# Altium project Macropad_2025.PrjPcb
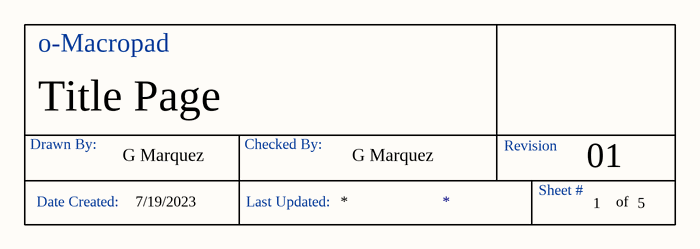
[diagram p0: Title Block.SchDoc]
Author: G Marquez; Project: o-Macropad
5 sheets, 55 parts. Net scope: flat (ports and power ports of the same name join across sheets).
Board file: Macropad2025.PcbDoc
Sheets:
  Title Block.SchDoc
  Power.SchDoc
  MCU.SchDoc
  Keyswitches.SchDoc
  Rotary LCD.SchDoc

## Sheet Title Block.SchDoc: Title Page
size B; Date: 7/19/2023; CheckedBy: G Marquez; Author: G Marquez; Organization: ORGANIZATION; Address1: ADDRESS 1; Address2: ADDRESS 2; Address3: ADDRESS 3; Address4: ADDRESS 4; Revision: 01; SheetNumber: 1; SheetTotal: 5; Project: o-Macropad; ENG_APP_DATE: --/--/--; DSN_APP_DATE: --/--/--; CHK_APP_DATE: --/--/--

### Parts
(Parts that share a designator on the sheet are numbered #1, #2 ... from top to bottom, then left to right.)
*#1  Title Block  (value not drawn)

### Notes on the sheet
- DWG. NO.
- REV.
- SHT.
- THIS DOCUMENT AND THE DATA DISCLOSED HEREIN OR HEREWITH IS THE PROPERTY OF ALTIUM LIMITED AND MAY BE FREELY DISTRIBUTED IN WHOLE. NO RIGHTS ARE RESERVED OR EXPRESS OR IMPLIED WARANTEE GIVEN.
- REVISION
- DESCRIPTION
- DATE
- APPROVED
- ENG:
- APPROVALS
- PROJECT
- DSN:
- CHK:
- REFERENCE DOCUMENTS
- PROJECT REVISION:
- TITLE
- DOCUMENT REVISION:
- DESIGN ITEM:
- BOM:
- FAB DWG:
- PCB DWG:
- ASSY DWG:
- SCALE:
- SIZE
- B
- CAGE CODE
- FILE NAME
- DWG NO.
- SHEET
- OF
- REV
- (in symbol Title Block) Drawn By:; Checked By:; Revision; Sheet #; Date Created:; Last Updated:; of

## Sheet Power.SchDoc: Power Supply
size B; Date: 7/29/2023; Revision: 00; SheetNumber: 2; SheetTotal: 5
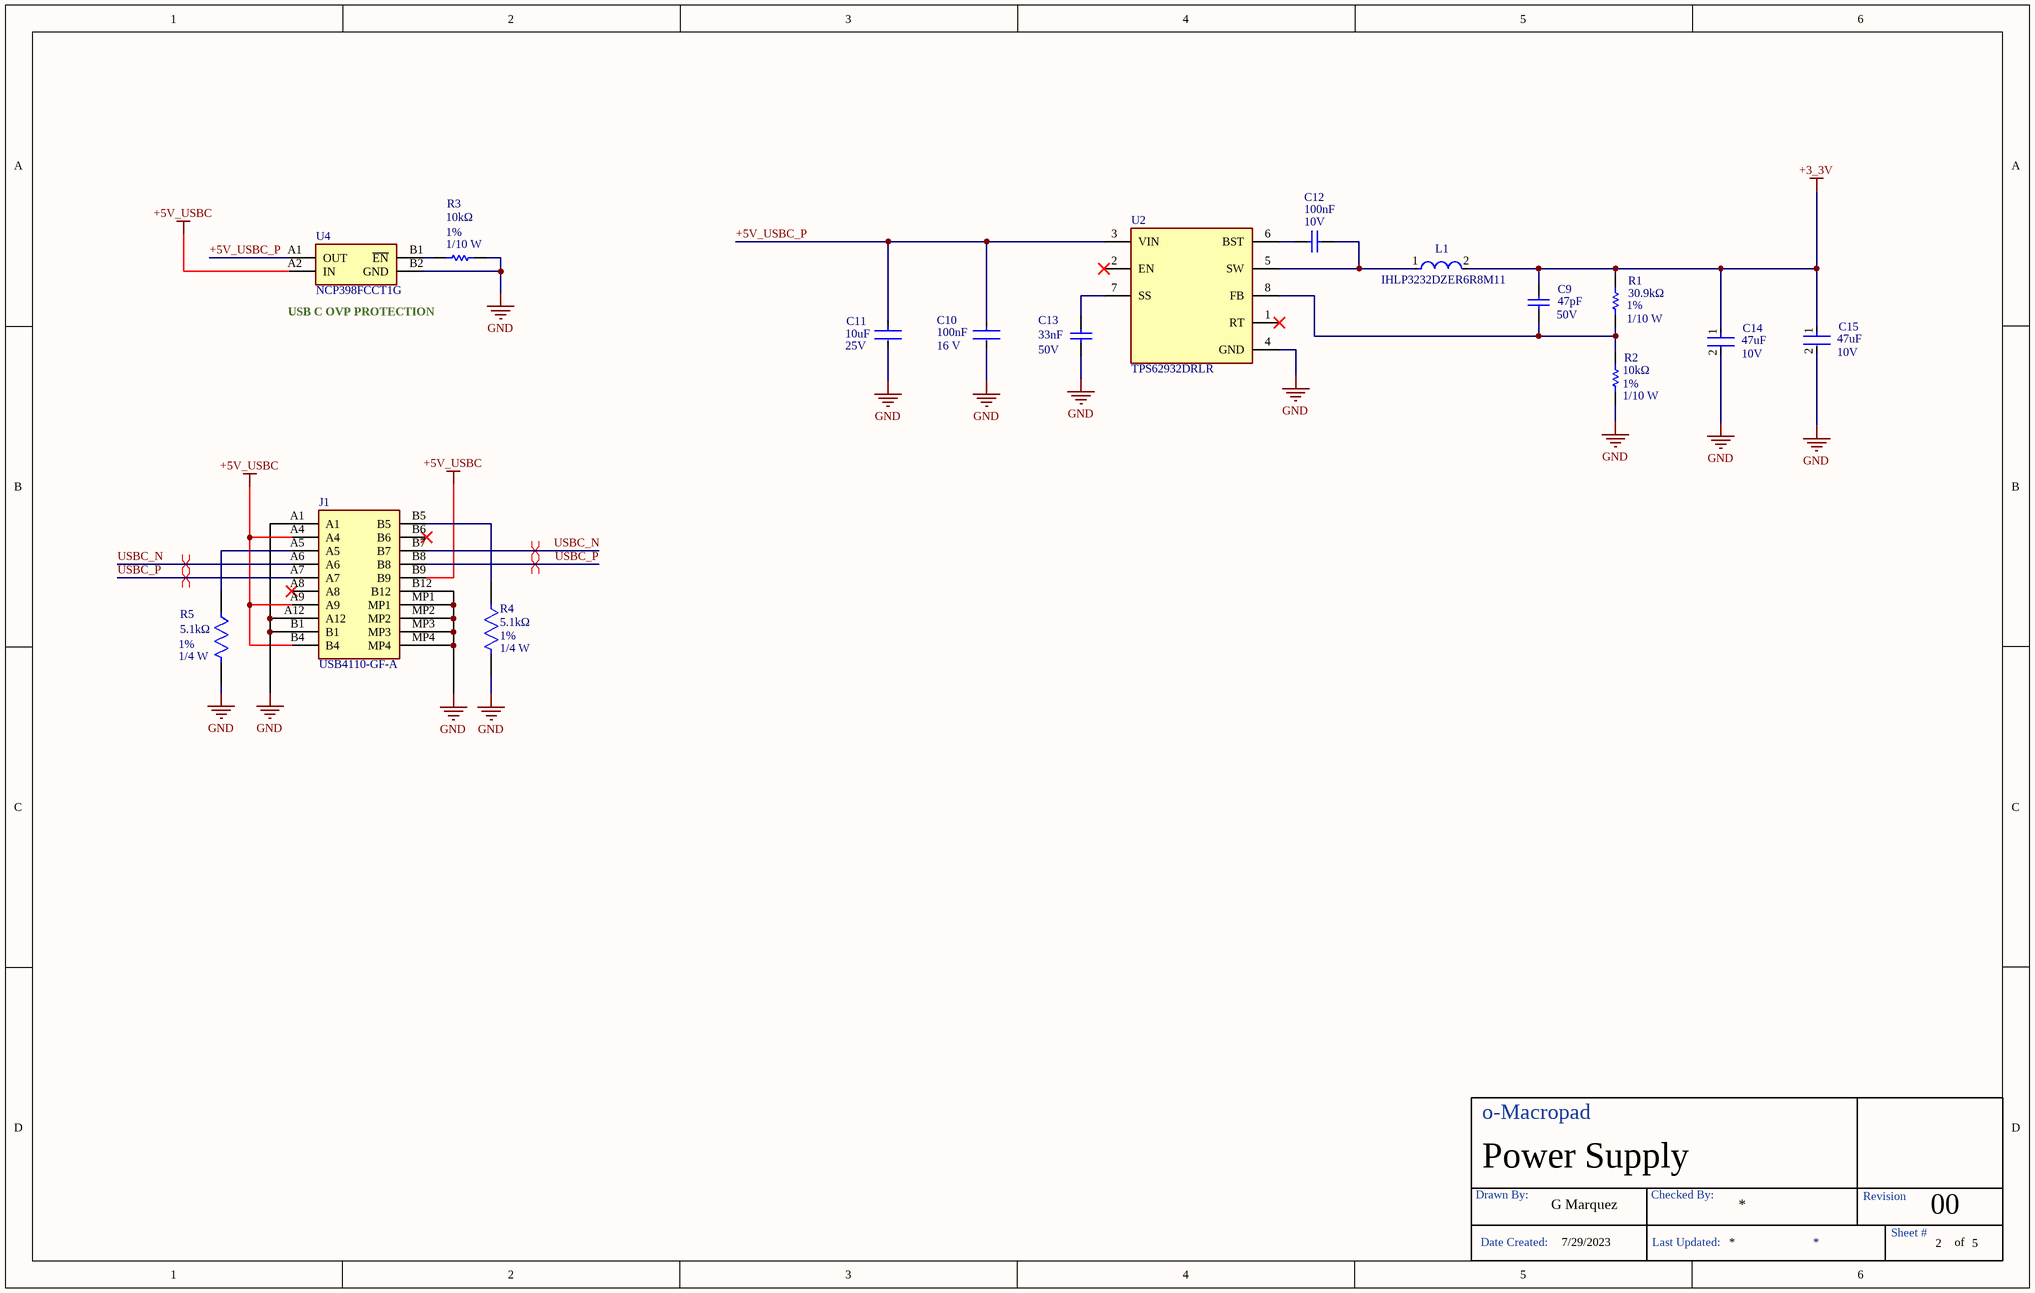
[diagram p1: Power.SchDoc]

### Parts
(Parts that share a designator on the sheet are numbered #1, #2 ... from top to bottom, then left to right.)
?#1  Title Block  (value not drawn)
C9  Capacitance: 47pF  Voltage Rating: 50V  [CAPC1608X90X35LL10T15]  (hidden comment: GQM1885C1H470JB01D)
C10  Capacitance: 100nF  Voltage Rating: 16 V  [FP-C0603C-CF-MFG]  (hidden comment: C0603C104K4RACTU)
C11  Voltage Rating: 25V  Capacitance: 10uF  [FP-C1608-080-IPC_A]  (hidden comment: C1608X5R1E106M080AC)
C12  Rated Voltage: 10V  Capacitance: 100nF  [CAPC1005X55X25LL05T10]  (hidden comment: GRM155R71A104KA01D)
C13  Capacitance: 33nF  Voltage Rating: 50V  [CAPC1608X90X35NL10T15]  (hidden comment: GRM188R71H333KA61D)
C14  Capacitance: 47uF  Voltage Rating: 10V  [FP-C2012-125-0_2-IPC_B]  (hidden comment: C2012X5R1A476M125AC)
C15  Capacitance: 47uF  Voltage Rating: 10V  [FP-C2012-125-0_2-IPC_B]  (hidden comment: C2012X5R1A476M125AC)
J1  USB4110-GF-A  [USB4110GFA]
L1  IHLP3232DZER6R8M11  [FP-IHLP-3232DZ-FP_2_413x5-MFG]
R1  Resistance: 30.9kΩ  Tolerance: 1%  Power Rating: 1/10 W  [RESC1609X50X30LL10T20]  (hidden comment: CRCW060330K9FKEA)
R2  Resistance: 10kΩ  Tolerance: 1%  Power Rating: 1/10 W  [RESC1609X50X30NL8T20]  (hidden comment: CRCW060310K0FKEA)
R3  Resistance: 10kΩ  Tolerance: 1%  Power Rating: 1/10 W  [RESC1609X50X30NL8T20]  (hidden comment: CRCW060310K0FKEA)
R4  Tolerance: 1%  Max Power Dissipation: 1/4 W  Resistance: 5.1kΩ  [FP-CRCW0603-HPe3-MFG]  (hidden comment: CRCW06035K10FKEAHP)
R5  Tolerance: 1%  Max Power Dissipation: 1/4 W  Resistance: 5.1kΩ  [FP-CRCW0603-HPe3-MFG]  (hidden comment: CRCW06035K10FKEAHP)
U2  TPS62932DRLR  [FP-DRL0008A-MFG]
U4  NCP398FCCT1G  [BGA4C40P2X2_84X84X60]

### Nets
+3_3V: C9.2 C14.1 C15.1 L1.2 R1.2
+5V_USBC: J1.A4 J1.A9 J1.B4 J1.B9 U4.A2(IN)
GND: C10.2 C11.2 C13.1 C14.2 C15.2 J1.A1 J1.A12 J1.B1 J1.B12 J1.MP1 J1.MP2 J1.MP3 J1.MP4 R2.1 R3.1 R4.2 R5.2 U2.4(GND) U4.B2(GND)
+5V_USBC_P: C10.1 C11.1 U2.3(VIN) U4.A1(OUT)
USBC_N: J1.A6 J1.B7
USBC_P: J1.A7 J1.B8
NetC9_1: C9.1 R1.1 R2.2 U2.8(FB)
NetC12_1: C12.1 U2.6(BST)
NetC12_2: C12.2 L1.1 U2.5(SW)
NetC13_2: C13.2 U2.7(SS)
NetJ1_A5: J1.A5 R5.1
NetJ1_B5: J1.B5 R4.1
NetR3_2: R3.2 U4.B1(~{EN})

Not connected (* = marked no-connect by the designer): J1 A8* B6*; U2 1(RT)* 2(EN)*

### Layout directives
differential pair: USBC_N, USBC_P

### Notes on the sheet
- (near U4) USB C OVP PROTECTION
- (in symbol Title Block) Drawn By:; Checked By:; Revision; Sheet #; Date Created:; Last Updated:; of

### Library data of the parts
C9 = CMP-2006-02430-1: Manufacturer: Murata; Part Number: GQM1885C1H470JB01D
C10 = CMP-2006-03811-3: Capacitor; Ceramic; Cap; .100uF; Tol 10%; SMT; Vol-Rtg 16V; X7R; Tape and Reel; Manufacturer: KEMET; Value: 0.10 μF; Temperature Coefficient: 30ppm/°C; Automotive Grade: Grade 1; Tolerance: 0.1; Digikey Description: Capacitor; Ceramic; Cap; .100uF; Tol 10%; SMT; Vol-Rtg 16V; X7R; Tape and Reel; Automotive: Yes; Temperature Range High: +125°C; Device Class L1: Passive Components; Material: Ceramic; Lead Free: Yes; Device Class L2: Capacitors; Height: 0.87mm; Manufacturer Part Number: C0603C104K4RACTU; Octopart: https://octopart.com/c0603c104k4ractu-kemet-93067; Package: C0603C-CF; Temperature Characteristic: X7R; Device Class L3: Ceramic Capacitors; ComponentLink2URL: https://api.kemet.com/component-edge/download/datasheet/C0603C100J5GACAUTO.pdf; Temperature Range Low: -55°C; ComponentLink2Description: Datasheet; Mouser Description: Multilayer Ceramic Capacitors MLCC - SMD/SMT 16volts 0.1uF 10% X7R 10%; RoHS: TRUE; Temperature: -55°C to +125°C; Category: Cap
C11 = CMP-2000-05442-2: CAP CER 10UF 25V X5R 0603; Dielectric Material: Ceramic; Tolerance: 20%; Dielectric: X5R; Length: 1.6mm; Termination: SMD/SMT; Depth: 0.8mm; RoHS Compliant: Yes; Construction: Flat; Weight: 7.1E-05oz; Thickness: 0.039inch; Packaging: Tape and Reel; Min Operating Temperature: -55°C; Case Code (Imperial): 0603; Case/Package: 0603; Height: 0.8mm; Case Code (Metric): 1608; Resistor Type: Ceramic; Voltage Rating (DC): 25V; Max Operating Temperature: 85°C; REACH SVHC: No SVHC; Lead Free: Lead Free; Series: C; Width: 0.8mm; Mount: Surface Mount; Package Quantity: 1
C12 = CMP-2000-06331-1: Chip Capacitor, 0.1 uF, +/- 10%, 10 V, -55 to 125 degC, 0402 (1005 Metric), RoHS, Tape and Reel; Manufacturer: Murata; Dielectric: X7R; Manufacturer URL: http://www.murata.com/; Datasheet Version: 02/2016; Datasheet URL: http://search.murata.co.jp/Ceramy/image/img/A01X/G101/ENG/GRM155R71A104KA01-01.pdf; Package Reference: 0402; Tolerance (%): ±10%; Package Description: 2-Pin Surface Mount Device, Body 1 x 0.5 mm; Mounting Technology: SurfaceMount; Case Size/Dimension: 0402
C13 = CMP-2006-02918-1: Manufacturer: Murata; Part Number: GRM188R71H333KA61D
C14 C15 = CMP-2000-05451-2: Multilayer Ceramic Capacitors 47μF ±20% 10V X5R SMD 0805; RoHS Compliant: Yes; Dielectric: X5R; Case Code (Imperial): 0805; Min Operating Temperature: -55°C; Length: 2mm; Lead Free: Lead Free; Weight: 0.000194oz; Resistor Type: Ceramic; Dielectric Material: Ceramic; Max Operating Temperature: 85°C; Height: 1.25mm; Width: 0.049inch; Depth: 1.25mm; Termination: SMD/SMT; Case/Package: 0805; Voltage Rating (DC): 10V; Voltage: 10V; Thickness: 0.057inch; Tolerance: 20%; REACH SVHC: No SVHC; Package Quantity: 1; Series: C; Case Code (Metric): 2012; Mount: Surface Mount; Packaging: Tape and Reel
J1 = USB4110-GF-A: Connector; Manufacturer_Name: GCT (GLOBAL CONNECTOR TECHNOLOGY); Datasheet Link: https://gct.co/files/drawings/usb4110.pdf; Height: 3.26mm; Manufacturer_Part_Number: USB4110-GF-A
L1 = CMP-02424-000226-1: Commercial Inductors, Low DCR Series 6.8uH 7A 33.4mΩ 20%; Test Frequency: 100kHz; Max DC Current: 6.7A; Core Material: Ferrite; DC Resistance (DCR): 33.4mR; Self Resonant Frequency: 13MHz; Shielding: Shielded; Lead Free: Lead Free; Min Operating Temperature: -55°C; Max Operating Temperature: 125°C; Military Standard: Not; Number of Pins: 2; Length: 0.34inch; Width: 8.18mm; Height - Seated (Max): 0.157inch; Depth: 8.26mm; Package Quantity: 500; Packaging: Tape and Reel; Inductance Tolerance: 20%; Saturation Current: 6.7A; Tolerance: 20%; Mount: Surface Mount; RMS Current (Irms): 7A; Termination: SMD/SMT; Current Rating: 7A; Height: 4mm; Case/Package: 3232; Radiation Hardening: No; Inductance: 6.8uH
R1 = CMP-2000-03227-1: Manufacturer: Vishay Dale; Part Number: CRCW060330K9FKEA
R2 R3 = CMP-1666-00005-4: Chip Resistor, 10 KOhm, +/- 1%, 100 mW, -55 to 155 degC, 0603 (1608 Metric), RoHS, Tape and Reel; Manufacturer: Vishay Semiconductor; Voltage Rating: 75 V; Max Operating Temperature: 155 degC; PackageDescription: 2-Pin Surface Mount Device, Body 1.575 x 0.85 mm; ComponentLink1Description: Manufacturer URL; RoHSCompliant: true; PackageReference: 0603; REACH SVHC: Unknown; Length: 1.55 mm; DatasheetVersion: 06/2012; Packaging: Tape and Reel; Min Operating Temperature: -55 degC; Mounting Technology: Surface Mount; ComponentLink2URL: https://datasheet.ciiva.com/11809/0900766b80d98afc-11809037.pdf; Height: 0.45 mm; ComponentLink2Description: Datasheet; Package Quantity: 5000; ComponentLink1URL: http://www.vishay.com/
R4 R5 = CMP-02407-006055-1: RES Thick Film, 5.1kΩ, 1%, 0.33W, 100ppm/°C, 0603; Power Rating: 250mW; Width: 0.033inch; Mount: Surface Mount; Number of Terminations: 2; Depth: 0.85mm; Case Code (Metric): 1608; Height: 0.022inch; Features: Automotive AEC-Q200; Military Standard: Not; Max Operating Temperature: 155°C; Contact Plating: Tin; Packaging: Tape and Reel; Temperature Coefficient: 100ppm/°C; Case/Package: 0603; Composition: Thick Film; Min Operating Temperature: -55°C; Length: 1.6mm; Radiation Hardening: No; Case Code (Imperial): 0603; Lead Free: Lead Free; Package Quantity: 5000
U2 = CMP-04918-000714-1: 3.8-V TO 30-V INPUT, 2-A, 200-KH
U4 = NCP398FCCT1G: Integrated Circuit; Manufacturer_Name: onsemi; Datasheet Link: https://www.onsemi.com/pub/Collateral/NCP398-D.PDF; Height: 0.6mm; Manufacturer_Part_Number: NCP398FCCT1G; Mouser Part Number: 863-NCP398FCCT1G; Mouser Price/Stock: https://www.mouser.co.uk/ProductDetail/onsemi/NCP398FCCT1G?qs=8hV9pjh0QhMpkPl4ZTT5TA%3D%3D; Arrow Part Number: NCP398FCCT1G; Arrow Price/Stock: https://www.arrow.com/en/products/ncp398fcct1g/on-semiconductor

## Sheet MCU.SchDoc: Microprocessor
size B; Date: 7/18/2023; CheckedBy: G Marquez; Author: G Marquez; Organization: ORGANIZATION; Address1: ADDRESS 1; Address2: ADDRESS 2; Address3: ADDRESS 3; Address4: ADDRESS 4; Revision: 01; SheetNumber: 3; SheetTotal: 5; Project: o-Macropad; ENG_APP_DATE: --/--/--; DSN_APP_DATE: --/--/--; CHK_APP_DATE: --/--/--
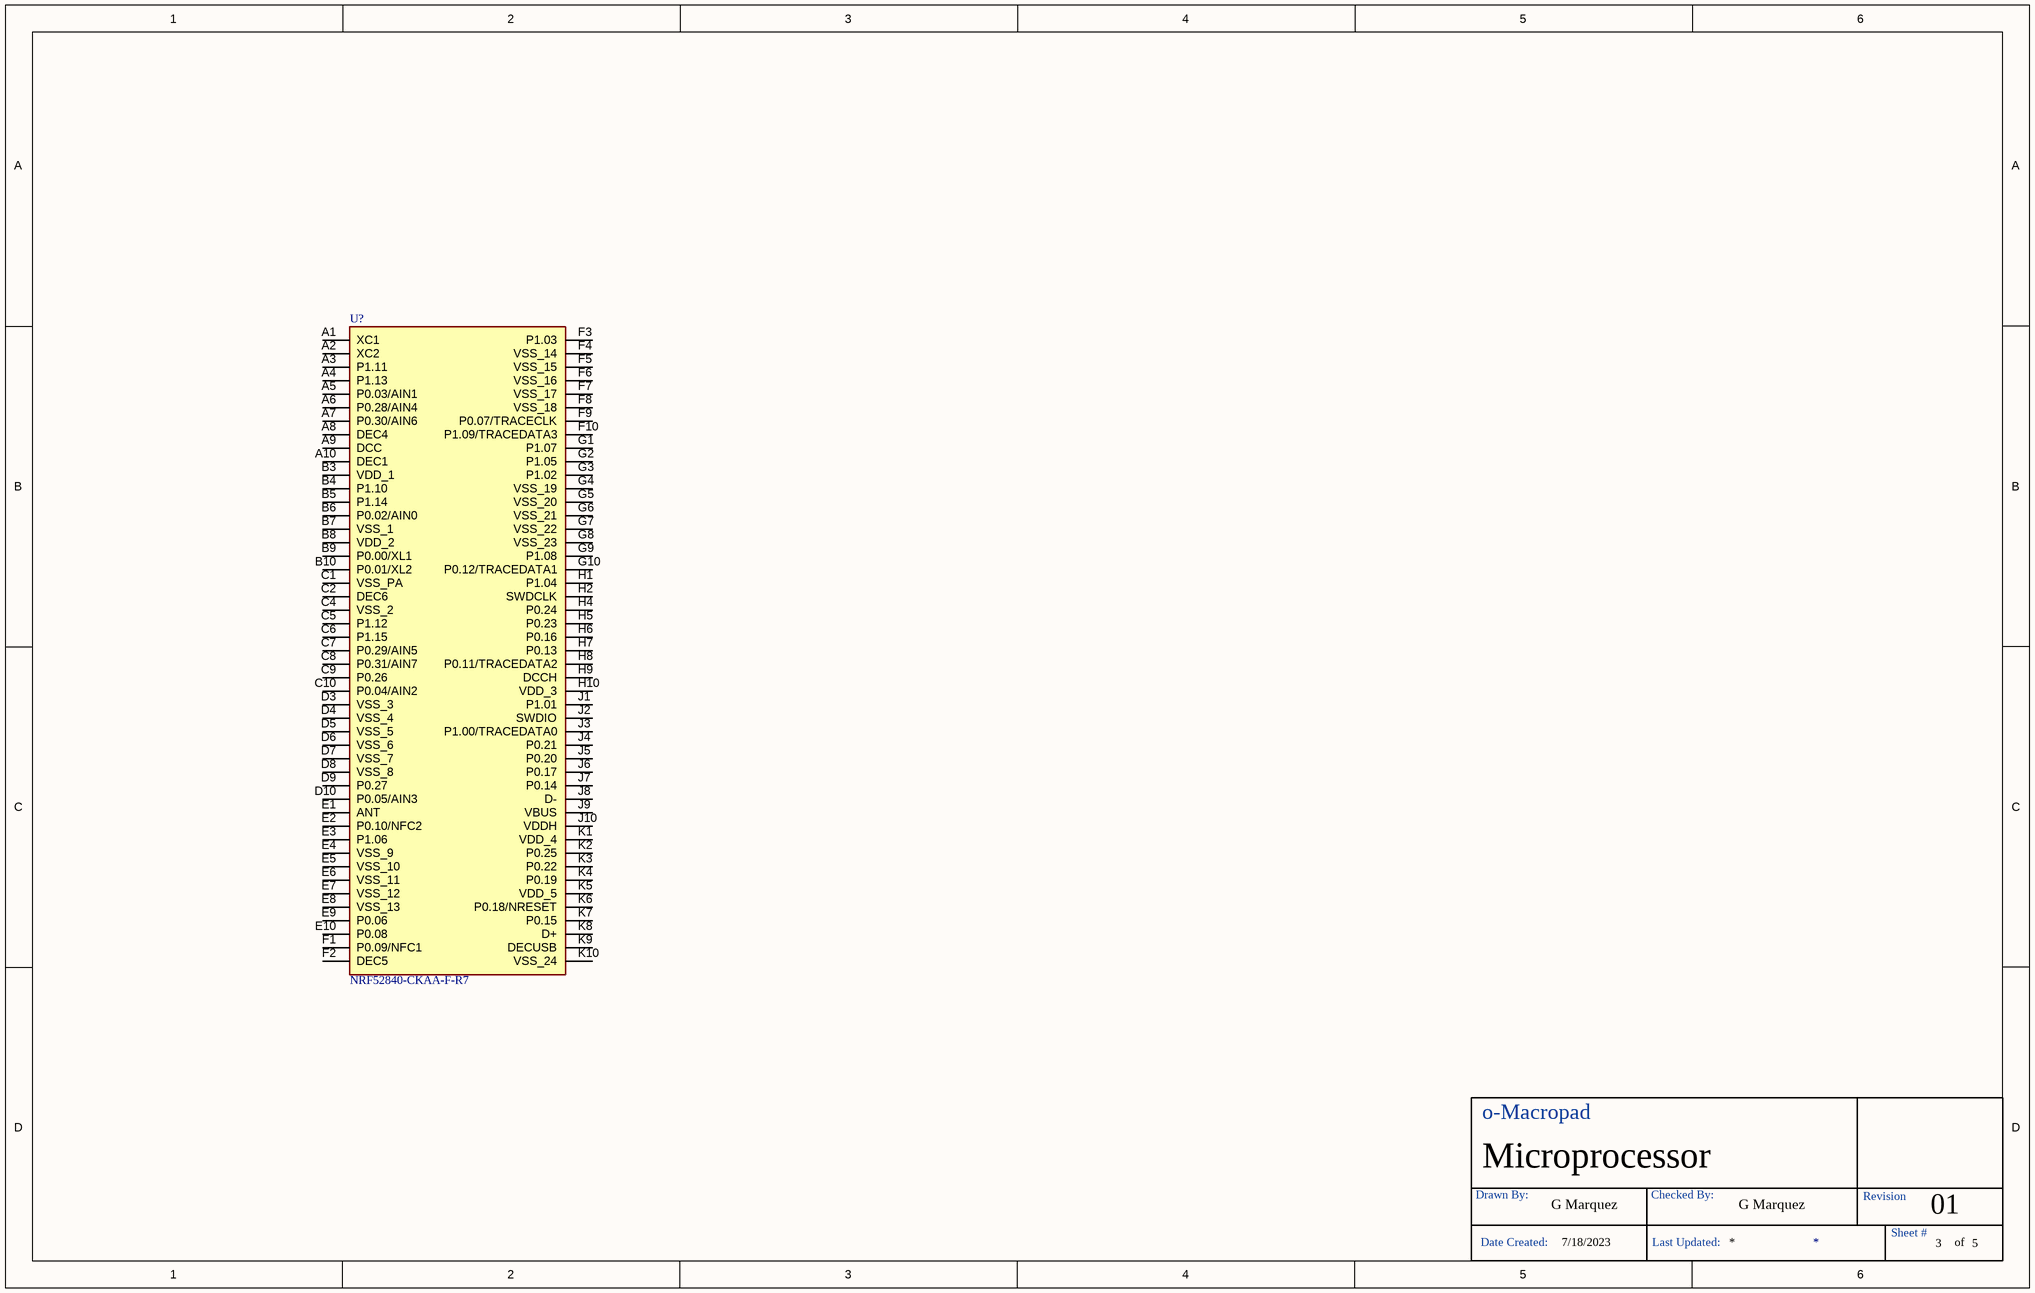
[diagram p2: MCU.SchDoc]

### Parts
(Parts that share a designator on the sheet are numbered #1, #2 ... from top to bottom, then left to right.)
*#2  Title Block  (value not drawn)
U?  NRF52840-CKAA-F-R7  [BGA94C35P10X10_354X361X51]

### Nets

Not connected (* = marked no-connect by the designer): U? A1(XC1) A2(XC2) A3(P1.11) A4(P1.13) A5(P0.03/AIN1) A6(P0.28/AIN4) A7(P0.30/AIN6) A8(DEC4) A9(DCC) A10(DEC1) B3(VDD_1) B4(P1.10) B5(P1.14) B6(P0.02/AIN0) B7(VSS_1) B8(VDD_2) B9(P0.00/XL1) B10(P0.01/XL2) C1(VSS_PA) C2(DEC6) C4(VSS_2) C5(P1.12) C6(P1.15) C7(P0.29/AIN5) C8(P0.31/AIN7) C9(P0.26) C10(P0.04/AIN2) D3(VSS_3) D4(VSS_4) D5(VSS_5) D6(VSS_6) D7(VSS_7) D8(VSS_8) D9(P0.27) D10(P0.05/AIN3) E1(ANT) E2(P0.10/NFC2) E3(P1.06) E4(VSS_9) E5(VSS_10) E6(VSS_11) E7(VSS_12) E8(VSS_13) E9(P0.06) E10(P0.08) F1(P0.09/NFC1) F2(DEC5) F3(P1.03) F4(VSS_14) F5(VSS_15) F6(VSS_16) F7(VSS_17) F8(VSS_18) F9(P0.07/TRACECLK) F10(P1.09/TRACEDATA3) G1(P1.07) G2(P1.05) G3(P1.02) G4(VSS_19) G5(VSS_20) G6(VSS_21) G7(VSS_22) G8(VSS_23) G9(P1.08) G10(P0.12/TRACEDATA1) H1(P1.04) H2(SWDCLK) H4(P0.24) H5(P0.23) H6(P0.16) H7(P0.13) H8(P0.11/TRACEDATA2) H9(DCCH) H10(VDD_3) J1(P1.01) J2(SWDIO) J3(P1.00/TRACEDATA0) J4(P0.21) J5(P0.20) J6(P0.17) J7(P0.14) J8(D-) J9(VBUS) J10(VDDH) K1(VDD_4) K2(P0.25) K3(P0.22) K4(P0.19) K5(VDD_5) K6(P0.18/NRESET) K7(P0.15) K8(D+) K9(DECUSB) K10(VSS_24)

### Notes on the sheet
- DWG. NO.
- REV.
- SHT.
- THIS DOCUMENT AND THE DATA DISCLOSED HEREIN OR HEREWITH IS THE PROPERTY OF ALTIUM LIMITED AND MAY BE FREELY DISTRIBUTED IN WHOLE. NO RIGHTS ARE RESERVED OR EXPRESS OR IMPLIED WARANTEE GIVEN.
- REVISION
- DESCRIPTION
- DATE
- APPROVED
- ENG:
- APPROVALS
- PROJECT
- DSN:
- CHK:
- REFERENCE DOCUMENTS
- PROJECT REVISION:
- TITLE
- DOCUMENT REVISION:
- DESIGN ITEM:
- BOM:
- FAB DWG:
- PCB DWG:
- ASSY DWG:
- SCALE:
- SIZE
- B
- CAGE CODE
- FILE NAME
- DWG NO.
- SHEET
- OF
- REV
- (in symbol Title Block) Drawn By:; Checked By:; Revision; Sheet #; Date Created:; Last Updated:; of

### Library data of the parts
U? = NRF52840-CKAA-F-R7: Integrated Circuit; Manufacturer_Name: Nordic Semiconductor; Datasheet Link: https://infocenter.nordicsemi.com/pdf/nRF52840_PS_v1.7.pdf; Height: 0.514mm; Manufacturer_Part_Number: NRF52840-CKAA-F-R7; Mouser Part Number: 949-NRF52840CKAAF-R7; Mouser Price/Stock: https://www.mouser.co.uk/ProductDetail/Nordic-Semiconductor/nRF52840-CKAA-F-R7?qs=TCDPyi3sCW3UO0%252BPeBf5YQ%3D%3D; Arrow Part Number: NRF52840-CKAA-F-R7; Arrow Price/Stock: https://www.arrow.com/en/products/nrf52840-ckaa-f-r7/nordic-semiconductor?utm_currency=USD&region=nac

## Sheet Keyswitches.SchDoc: Key Switches & LED
size B; Date: 7/22/2023; Revision: 01; SheetNumber: 4; SheetTotal: 4
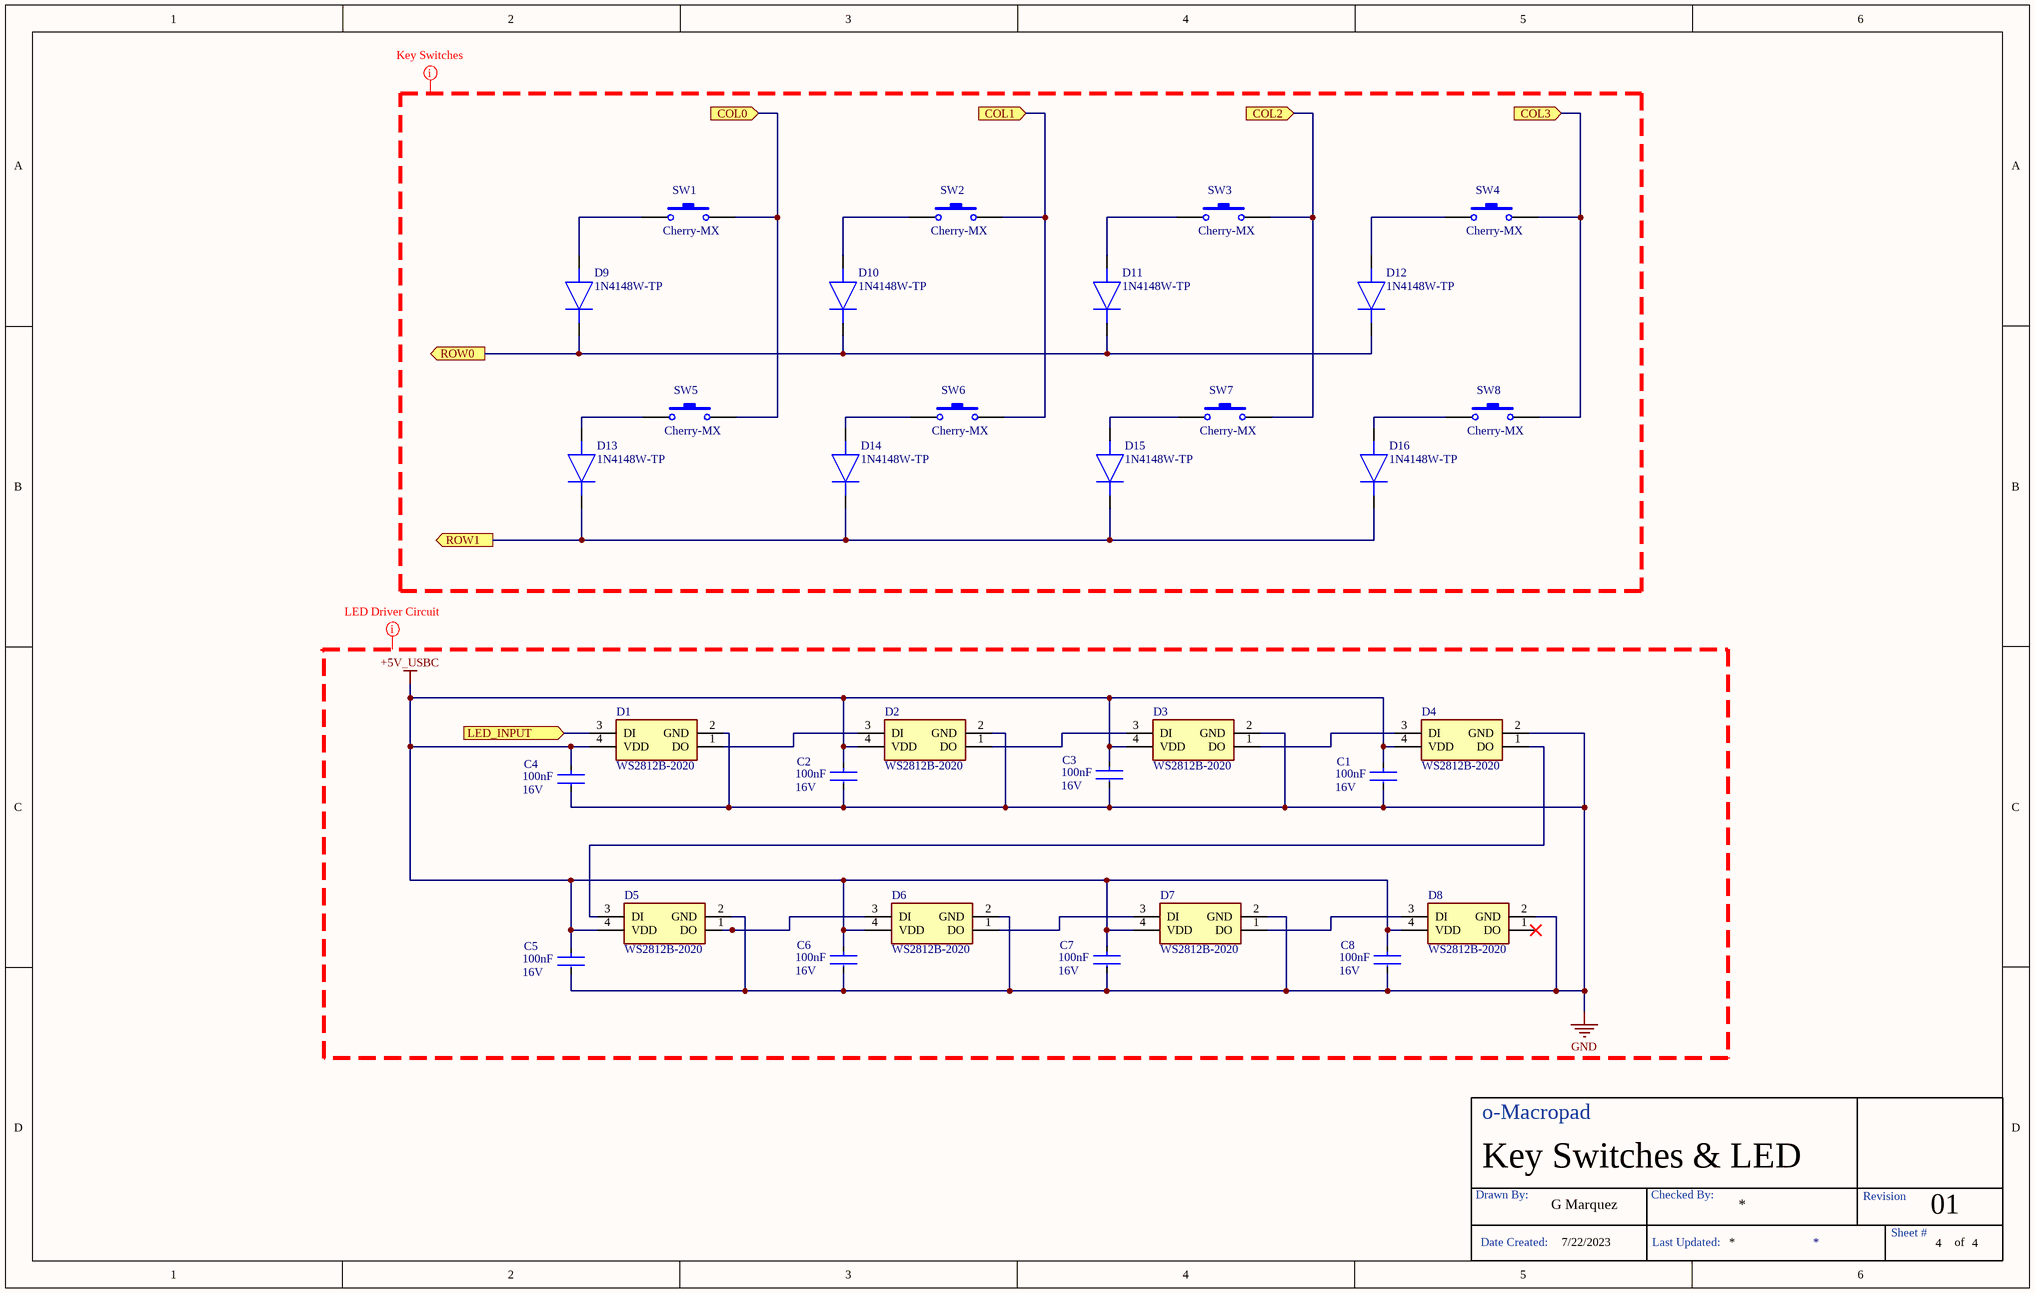
[diagram p3: Keyswitches.SchDoc]

### Parts
(Parts that share a designator on the sheet are numbered #1, #2 ... from top to bottom, then left to right.)
?#2  Title Block  (value not drawn)
C1  Voltage Rating: 16V  Capacitance: 100nF  [FP-GRM15-MFG]  (hidden comment: GRM155R71C104KA88D)
C2  Voltage Rating: 16V  Capacitance: 100nF  [FP-GRM15-MFG]  (hidden comment: GRM155R71C104KA88D)
C3  Voltage Rating: 16V  Capacitance: 100nF  [FP-GRM15-MFG]  (hidden comment: GRM155R71C104KA88D)
C4  Voltage Rating: 16V  Capacitance: 100nF  [FP-GRM15-MFG]  (hidden comment: GRM155R71C104KA88D)
C5  Voltage Rating: 16V  Capacitance: 100nF  [FP-GRM15-MFG]  (hidden comment: GRM155R71C104KA88D)
C6  Voltage Rating: 16V  Capacitance: 100nF  [FP-GRM15-MFG]  (hidden comment: GRM155R71C104KA88D)
C7  Voltage Rating: 16V  Capacitance: 100nF  [FP-GRM15-MFG]  (hidden comment: GRM155R71C104KA88D)
C8  Voltage Rating: 16V  Capacitance: 100nF  [FP-GRM15-MFG]  (hidden comment: GRM155R71C104KA88D)
D1  WS2812B-2020  [WS2812B2020]
D2  WS2812B-2020  [WS2812B2020]
D3  WS2812B-2020  [WS2812B2020]
D4  WS2812B-2020  [WS2812B2020]
D5  WS2812B-2020  [WS2812B2020]
D6  WS2812B-2020  [WS2812B2020]
D7  WS2812B-2020  [WS2812B2020]
D8  WS2812B-2020  [WS2812B2020]
D9  1N4148W-TP  [SOD3715X135N]
D10  1N4148W-TP  [SOD3715X135N]
D11  1N4148W-TP  [SOD3715X135N]
D12  1N4148W-TP  [SOD3715X135N]
D13  1N4148W-TP  [SOD3715X135N]
D14  1N4148W-TP  [SOD3715X135N]
D15  1N4148W-TP  [SOD3715X135N]
D16  1N4148W-TP  [SOD3715X135N]
SW1  Cherry-MX  [CHERRYMX_1.00U_HOTSWAP_NOSILK]
SW2  Cherry-MX  [CHERRYMX_1.00U_HOTSWAP_NOSILK]
SW3  Cherry-MX  [CHERRYMX_1.00U_HOTSWAP_NOSILK]
SW4  Cherry-MX  [CHERRYMX_1.00U_HOTSWAP_NOSILK]
SW5  Cherry-MX  [CHERRYMX_1.00U_HOTSWAP_NOSILK]
SW6  Cherry-MX  [CHERRYMX_1.00U_HOTSWAP_NOSILK]
SW7  Cherry-MX  [CHERRYMX_1.00U_HOTSWAP_NOSILK]
SW8  Cherry-MX  [CHERRYMX_1.00U_HOTSWAP_NOSILK]

### Ports
COL0 (in), COL1 (in), COL2 (in), COL3 (in), LED_INPUT (in), ROW0 (out), ROW1 (out)

### Nets
+5V_USBC: C1.2 C2.2 C3.2 C4.2 C5.2 C6.2 C7.2 C8.2 D1.4(VDD) D2.4(VDD) D3.4(VDD) D4.4(VDD) D5.4(VDD) D6.4(VDD) D7.4(VDD) D8.4(VDD)
GND: C1.1 C2.1 C3.1 C4.1 C5.1 C6.1 C7.1 C8.1 D1.2(GND) D2.2(GND) D3.2(GND) D4.2(GND) D5.2(GND) D6.2(GND) D7.2(GND) D8.2(GND)
NetD1_1: D1.1(DO) D2.3(DI)
NetD1_3: D1.3(DI) ; port LED_INPUT
NetD2_1: D2.1(DO) D3.3(DI)
NetD3_1: D3.1(DO) D4.3(DI)
NetD4_1: D4.1(DO) D5.3(DI)
NetD5_1: D5.1(DO) D6.3(DI)
NetD6_1: D6.1(DO) D7.3(DI)
NetD7_1: D7.1(DO) D8.3(DI)
NetD9_1: D9.1(K) D10.1(K) D11.1(K) D12.1(K) ; port ROW0
NetD9_2: D9.2(A) SW1.1
NetD10_2: D10.2(A) SW2.1
NetD11_2: D11.2(A) SW3.1
NetD12_2: D12.2(A) SW4.1
NetD13_1: D13.1(K) D14.1(K) D15.1(K) D16.1(K) ; port ROW1
NetD13_2: D13.2(A) SW5.1
NetD14_2: D14.2(A) SW6.1
NetD15_2: D15.2(A) SW7.1
NetD16_2: D16.2(A) SW8.1
NetSW1_2: SW1.2 SW5.2 ; port COL0
NetSW2_2: SW2.2 SW6.2 ; port COL1
NetSW3_2: SW3.2 SW7.2 ; port COL2
NetSW4_2: SW4.2 SW8.2 ; port COL3

Not connected (* = marked no-connect by the designer): D8 1(DO)*

### Layout directives
mark named LED Driver Circuit: +5V_USBC, GND
mark named Key Switches: (no net found under the mark)

### Notes on the sheet
- (in symbol Title Block) Drawn By:; Checked By:; Revision; Sheet #; Date Created:; Last Updated:; of

### Library data of the parts
C1-C8 = CMP-2100-03641-2: CAP CER 0.1UF 16V X7R 0402; Manufacturer: Murata; Standoff Height: 0mm; Tolerance: 10%; Description: CAP Ceramic 0.10μF 10% X7R 16Vdc 0402 SMD; Material: Ceramic; Value: 0.10μF; RoHS: TRUE; Manufacturer Part Number: GRM155R71C104KA88D; Temperature Characteristic: X7R; Octopart: https://octopart.com/grm155r71c104ka88d-murata-196880; Digikey Description: CAP CER 0.1UF 16V X7R 0402; Device Class L3: Ceramic Capacitors; Height: 0.55mm; ComponentLink2Description: Datasheet; Temperature Range Low: -55°C; Ipc Land Pattern Name: CAPC10050X219; ComponentLink2URL: https://search.murata.co.jp/Ceramy/image/img/A01X/G101/ENG/GRM155R71H471KA01-01A.pdf; Device Class L1: Passive Components; Lead Free: yes; Category: Cap; Package: GRM15; Temperature: -55°C to +125°C; Device Class L2: Capacitors; Temperature Range High: +125°C; Mouser Description: 0402 0.1 uF 16V ±10 % Tolerance X7R SMT Multilayer Ceramic Capacitor
D1-D8 = WS2812B-2020: LED (Multiple); Manufacturer_Name: Worldsemi; Datasheet Link: https://www.alldatasheet.com/datasheet-pdf/pdf/1134522/WORLDSEMI/WS2812B-2020.html; Height: 0.84mm; Manufacturer_Part_Number: WS2812B-2020
D9-D16 = 1N4148W-TP: Diode; Manufacturer_Name: MCC; Datasheet Link: https://mccsemi.com/pdf/Products/1N4148W(SOD-123).pdf; Height: 1.35mm; Manufacturer_Part_Number: 1N4148W-TP; Mouser Part Number: 833-1N4148W-TP; Mouser Price/Stock: https://www.mouser.co.uk/ProductDetail/Micro-Commercial-Components-MCC/1N4148W-TP?qs=KFo7JewZbUH7wCMabJ4EeQ%3D%3D; Arrow Part Number: 1N4148W-TP; Arrow Price/Stock: https://www.arrow.com/en/products/1n4148w-tp/micro-commercial-components?region=europe

## Sheet Rotary LCD.SchDoc: Rotary LCD
size B; Date: 12/5/2023; Revision: 00; SheetNumber: 5; SheetTotal: 5
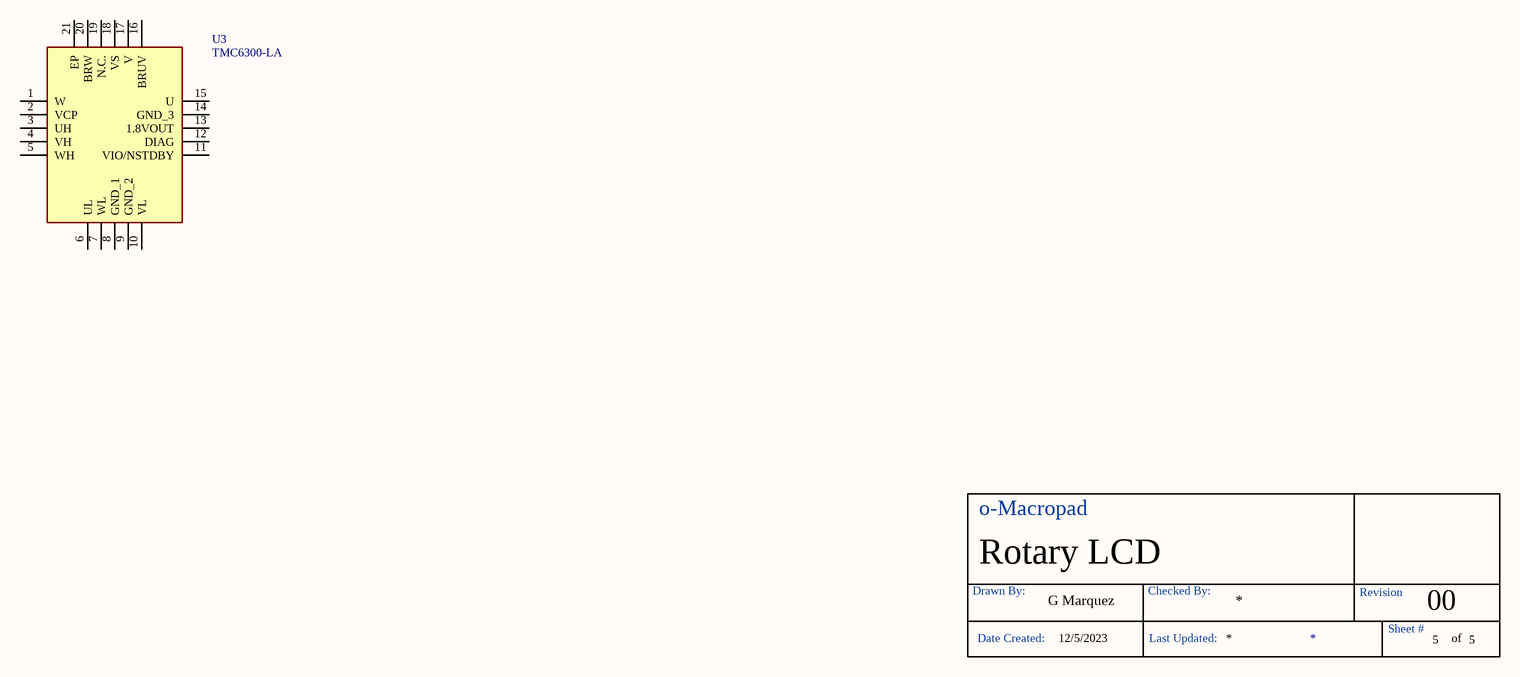
[diagram p4: Rotary LCD.SchDoc]

### Parts
(Parts that share a designator on the sheet are numbered #1, #2 ... from top to bottom, then left to right.)
?#3  Title Block  (value not drawn)
U3  TMC6300-LA  [QFN40P300X300X90-21N]

### Nets

Not connected (* = marked no-connect by the designer): U3 1(W) 2(VCP) 3(UH) 4(VH) 5(WH) 6(UL) 7(WL) 8(GND_1) 9(GND_2) 10(VL) 11(VIO/NSTDBY) 12(DIAG) 13(1.8VOUT) 14(GND_3) 15(U) 16(BRUV) 17(V) 18(VS) 19(N.C.) 20(BRW) 21(EP)

### Notes on the sheet
- (in symbol Title Block) Drawn By:; Checked By:; Revision; Sheet #; Date Created:; Last Updated:; of

### Library data of the parts
U3 = TMC6300-LA: Integrated Circuit; Manufacturer_Name: Analog Devices; Datasheet Link: https://www.analog.com/TMC6300/datasheet; Height: 0.9mm; Manufacturer_Part_Number: TMC6300-LA; Mouser Part Number: 700-TMC6300-LA; Mouser Price/Stock: https://www.mouser.co.uk/ProductDetail/ADI-Trinamic/TMC6300-LA?qs=QNEnbhJQKvYIagO3WUG%252BYg%3D%3D; Arrow Part Number: TMC6300-LA; Arrow Price/Stock: https://www.arrow.com/en/products/tmc6300-la/analog-devices?region=nac

## Nets that join several sheets
+5V_USBC: Power (5 pins), Keyswitches (16 pins)
GND: Power (19 pins), Keyswitches (16 pins)